# EAGLE design nixienet (EAGLE 6.3)
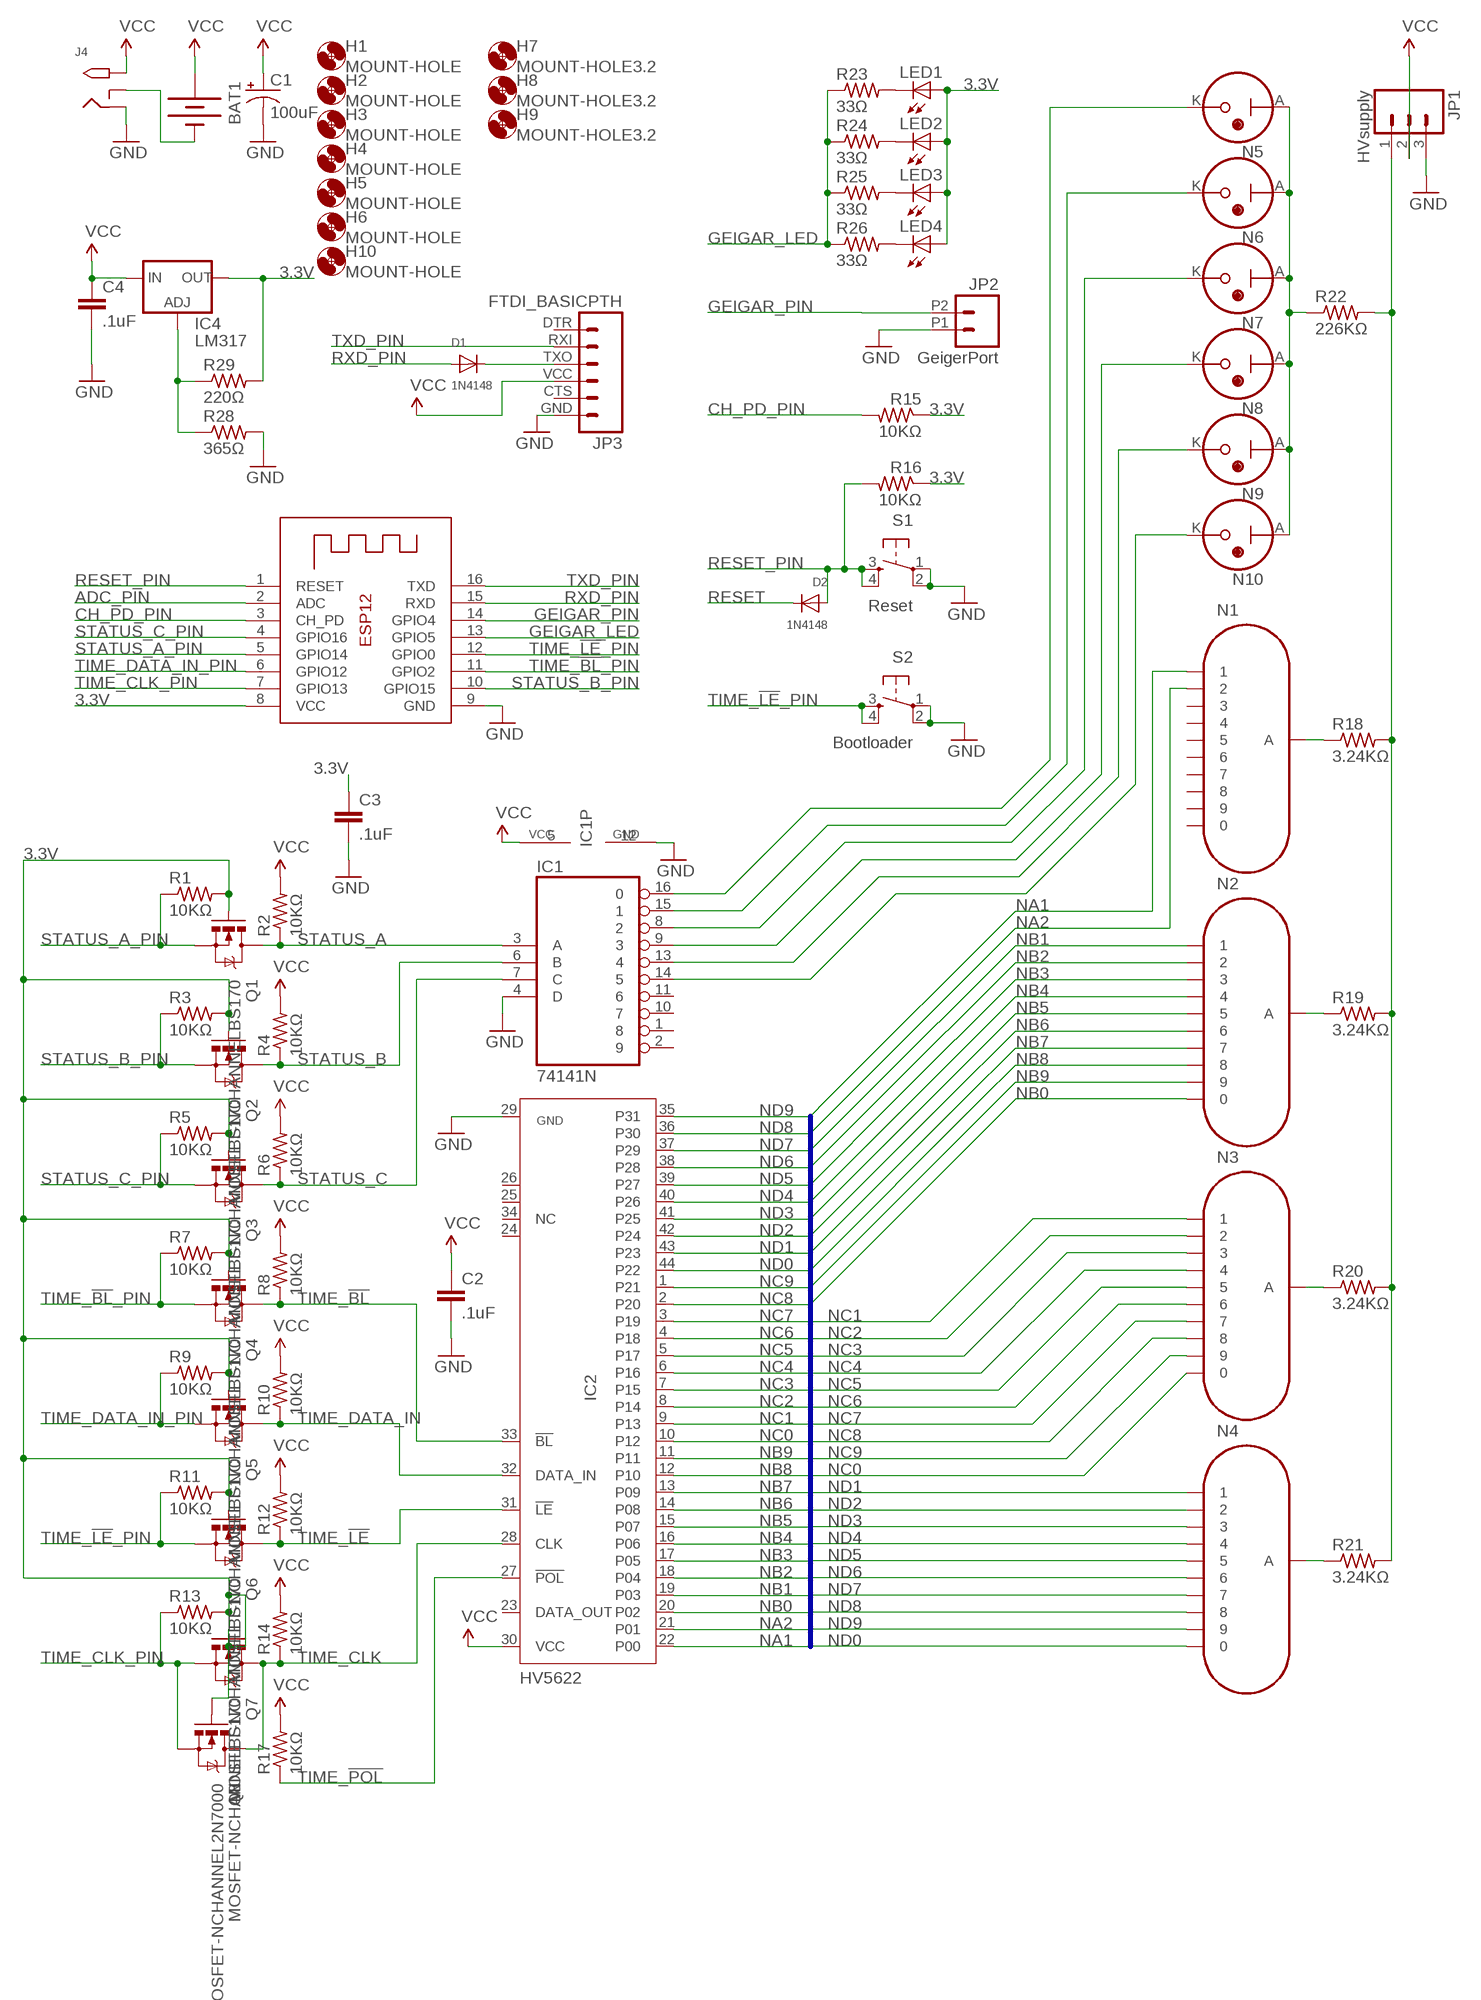
[diagram p0: schematic, sheet 1]

## Parts
BAT1  BATTERY9V  [BATTCON_9V]
C1  100uF  CPOL-USE5-8.5  [E5-8,5]
C2  .1uF  CAPEZ  [CAP-PTH-SMALLEZ]
C3  .1uF  CAPEZ  [CAP-PTH-SMALLEZ]
C4  .1uF  CAPEZ  [CAP-PTH-SMALLEZ]
D1  1N4148  DIODE  [1N4148]
D2  1N4148  DIODE  [1N4148]
H1  MOUNT-HOLE  [3,2-DANGER]
H2  MOUNT-HOLE  [3,2-DANGER]
H3  MOUNT-HOLE  [3,2-DANGER]
H4  MOUNT-HOLE  [3,2-DANGER]
H5  MOUNT-HOLE  [3,2-DANGER]
H6  MOUNT-HOLE  [3,2-DANGER]
H7  MOUNT-HOLE3.2  [3,2]
H8  MOUNT-HOLE3.2  [3,2]
H9  MOUNT-HOLE3.2  [3,2]
H10  MOUNT-HOLE  [3,2-DANGER]
IC1  74141N  [DIL16]
IC2  HV5622  [QFP44]
IC3  ESP-12  [ESP-12]
IC4  LM317  SPARKFUN-POWERIC_V_REG_317SINK  [SPARKFUN-POWERIC_TO220-ADJ]
J4  2.1MMJACKTHM  [PJ-102A]
JP1  HVsupply  M03-SCREW-5MM  [SCREWTERMINAL-5MM-3]
JP2  GeigerPort  M022.54MM_SCREWTERM  [1X02_2.54_SCREWTERM]
JP3  FTDI_BASICPTH  [FTDI_BASIC]
LED1  LED5MM  [LED5MM]
LED2  LED5MM  [LED5MM]
LED3  LED5MM  [LED5MM]
LED4  LED5MM  [LED5MM]
N1  Hour1  IN-4  [IN-18]
N2  Hour2  IN-4  [IN-18]
N3  Minutes1  IN-4  [IN-18]
N4  Minutes2  IN-4  [IN-18]
N5  TopBulb  INS-1  [INS-1]
N6  BottomBulb  INS-1  [INS-1]
N7  SunnyBulb  INS-1  [INS-1]
N8  CloudyBulb  INS-1  [INS-1]
N9  RainyBulb  INS-1  [INS-1]
N10  SnowyBulb  INS-1  [INS-1]
Q1  MOSFET-NCHANNELBS170  [TO-92]
Q2  MOSFET-NCHANNELBS170  [TO-92]
Q3  MOSFET-NCHANNELBS170  [TO-92]
Q4  MOSFET-NCHANNELBS170  [TO-92]
Q5  MOSFET-NCHANNELBS170  [TO-92]
Q6  MOSFET-NCHANNELBS170  [TO-92]
Q7  MOSFET-NCHANNELBS170  [TO-92]
Q8  MOSFET-NCHANNEL2N7000  [TO-92]
R1  10KΩ  R-US_0204/5  [0204/5]
R2  10KΩ  R-US_0204/5  [0204/5]
R3  10KΩ  R-US_0204/5  [0204/5]
R4  10KΩ  R-US_0204/5  [0204/5]
R5  10KΩ  R-US_0204/5  [0204/5]
R6  10KΩ  R-US_0204/5  [0204/5]
R7  10KΩ  R-US_0204/5  [0204/5]
R8  10KΩ  R-US_0204/5  [0204/5]
R9  10KΩ  R-US_0204/5  [0204/5]
R10  10KΩ  R-US_0204/5  [0204/5]
R11  10KΩ  R-US_0204/5  [0204/5]
R12  10KΩ  R-US_0204/5  [0204/5]
R13  10KΩ  R-US_0204/5  [0204/5]
R14  10KΩ  R-US_0204/5  [0204/5]
R15  10KΩ  R-US_0204/5  [0204/5]
R16  10KΩ  R-US_0204/5  [0204/5]
R17  10KΩ  R-US_0204/5  [0204/5]
R18  3.24KΩ  R-US_0204/5  [0204/5]
R19  3.24KΩ  R-US_0204/5  [0204/5]
R20  3.24KΩ  R-US_0204/5  [0204/5]
R21  3.24KΩ  R-US_0204/5  [0204/5]
R22  226KΩ  R-US_0204/5  [0204/5]
R23  33Ω  R-US_0204/5  [0204/5]
R24  33Ω  R-US_0204/5  [0204/5]
R25  33Ω  R-US_0204/5  [0204/5]
R26  33Ω  R-US_0204/5  [0204/5]
R28  365Ω  R-US_0204/5  [0204/5]
R29  220Ω  R-US_0204/5  [0204/5]
S1  Reset  TAC_SWITCHPTH  [TACTILE-PTH]
S2  Bootloader  TAC_SWITCHPTH  [TACTILE-PTH]

## Nets
3.3V [Power]: C3.1 IC3.8(VCC) IC4.OUT LED1.A LED2.A LED3.A LED4.A Q1.2(G) Q2.2(G) Q3.2(G) Q4.2(G) Q5.2(G) Q6.2(G) Q7.2(G) Q8.2(G) R1.2 R3.2 R5.2 R7.2 R9.2 R11.2 R13.2 R15.1 R16.1 R29.2
ADC_PIN: IC3.2(ADC)
CH_PD_PIN: IC3.3(CH_PD) R15.2
GEIGAR_LED: IC3.13(GPIO5) R23.1 R24.1 R25.1 R26.1
GEIGAR_PIN: IC3.14(GPIO4) JP2.P2
GND [Power]: C1.- C2.2 C3.2 C4.2 IC1.4(D) IC1.12(GND) IC2.29(GND) IC3.9(GND) J4.RING JP1.3 JP2.P1 JP3.GND R28.2 S1.1 S1.2 S2.1 S2.2
HV [Power]: JP1.1 R18.2 R19.2 R20.2 R21.2 R22.2
HV1 [Power]: N1.4(A) R18.1
HV2 [Power]: N2.4(A) R19.1
HV3 [Power]: N3.4(A) R20.1
HV4 [Power]: N4.4(A) R21.1
HVB [Power]: N5.A N6.A N7.A N8.A N9.A N10.A R22.1
N$1: IC4.ADJ R28.1 R29.1
N$2: IC1.14 N10.K
N$4: IC1.13 N9.K
N$5: IC1.9 N8.K
N$6: IC1.8 N7.K
N$7: IC1.15 N6.K
N$8: IC1.16 N5.K
N$18: D1.K(C) JP3.TXO
N$51: BAT1.- J4.RING_SW
N$52: LED1.K(C) R23.2
N$53: LED3.K(C) R25.2
N$54: LED4.K(C) R26.2
N$57: LED2.K(C) R24.2
NA1: IC2.22(P00) N1.14
NA2: IC2.21(P01) N1.9
NB0: IC2.20(P02) N2.8
NB1: IC2.19(P03) N2.14
NB2: IC2.18(P04) N2.9
NB3: IC2.17(P05) N2.11
NB4: IC2.16(P06) N2.1
NB5: IC2.15(P07) N2.12
NB6: IC2.14(P08) N2.2
NB7: IC2.13(P09) N2.6
NB8: IC2.12(P10) N2.3
NB9: IC2.11 N2.5
NC0: IC2.10(P12) N3.8
NC1: IC2.9(P13) N3.14
NC2: IC2.8(P14) N3.9
NC3: IC2.7(P15) N3.11
NC4: IC2.6(P16) N3.1
NC5: IC2.5(P17) N3.12
NC6: IC2.4(P18) N3.2
NC7: IC2.3(P19) N3.6
NC8: IC2.2(P20) N3.3
NC9: IC2.1(P21) N3.5
ND0: IC2.44(P22) N4.8
ND1: IC2.43(P23) N4.14
ND2: IC2.42(P24) N4.9
ND3: IC2.41(P25) N4.11
ND4: IC2.40(P26) N4.1
ND5: IC2.39(P27) N4.12
ND6: IC2.38(P28) N4.2
ND7: IC2.37(P29) N4.6
ND8: IC2.36(P30) N4.3
ND9: IC2.35(P31) N4.5
RESET: D2.K(C)
RESET_PIN: D2.A IC3.1(RESET) R16.2 S1.3 S1.4
RXD_PIN: D1.A IC3.15(RXD)
STATUS_A: IC1.3(A) Q1.1(D) R2.1
STATUS_A_PIN: IC3.5(GPIO14) Q1.3(S) R1.1
STATUS_B: IC1.6(B) Q2.1(D) R4.1
STATUS_B_PIN: IC3.10(GPIO15) Q2.3(S) R3.1
STATUS_C: IC1.7(C) Q3.1(D) R6.1
STATUS_C_PIN: IC3.4(GPIO16) Q3.3(S) R5.1
TIME_!BL: IC2.33(!BL) Q4.1(D) R8.1
TIME_!BL!_PIN: IC3.11(GPIO2) Q4.3(S) R7.1
TIME_!LE: IC2.31(!LE!) Q6.1(D) R12.1
TIME_!LE!_PIN: IC3.12(GPIO0) Q6.3(S) R11.1 S2.3 S2.4
TIME_!POL: IC2.27(!POL!) R17.1
TIME_CLK: IC2.28(CLK) Q7.1(D) Q8.3(D) R14.1
TIME_CLK_PIN: IC3.7(GPIO13) Q7.3(S) Q8.1(S) R13.1
TIME_DATA_IN: IC2.32(DATA_IN) Q5.1(D) R10.1
TIME_DATA_IN_PIN: IC3.6(GPIO12) Q5.3(S) R9.1
TXD_PIN: IC3.16(TXD) JP3.RXI
VCC [Power]: BAT1.+ C1.+ C2.1 C4.1 IC1.5(VCC) IC2.30(VCC) IC4.IN J4.TIP JP1.2 JP3.VCC R2.2 R4.2 R6.2 R8.2 R10.2 R12.2 R14.2 R17.2
Unconnected: IC1.1 IC1.2 IC1.10 IC1.11 IC2.23(DATA_OUT) IC2.24(NC) IC2.25(NC) IC2.26(NC) IC2.34(NC) JP3.CTS JP3.DTR N1.1 N1.2 N1.3 N1.5 N1.6 N1.8 N1.11 N1.12

## Buses
NA[1..2],NB[0..9],NC[0..9],ND[0..9]

## Library data of the parts
BAT1 = SparkFun-Electromechanical:BATTERY: Battery Holders Various common sizes : AA, AAA, 20mm coin cell and 12mm coin cell. 20MM_4LEGS, BATT-10373
C1 = adafruit:CPOL-US: POLARIZED CAPACITOR, American symbol
C2-C4 = SparkFun-Capacitors:CAP: Capacitor Standard 0603 ceramic capacitor, and 0.1" leaded capacitor.
D1 D2 = adafruit:DIODE: Diode SMADIODE - SMA Surface Mount Package 20V 1A Schottky Diode Digikey: 641-1014-6-ND DO-1N4148 - Through Hole Small Current Diode SOD-123 20V 1 A (.5mV Vf) Schottky Diode - Digikey: MBRX120TPMSCT-ND SOD-323 10V 570mA (.38mV Vf, 3ns) Schottky Diode - Digikey: ZLLS410CT-ND SOD-523 30V 30mA Schottky Diode (RB751S-40TE61) - Digikey: RB751S-40TE61CT-ND SOT23-R/W - SOT23 Package (R = Solder Paste/Reflow Ovens, W = Hand-Soldering) BAT54Film 40V 300mA - Digikey: 497-7162-1-ND
H1-H10 = holes:MOUNT-HOLE: MOUNTING HOLE with drill center marker
IC1 = 74xx-us:74*141: BCD to decimal DECODER/DRIVER
IC2 = nixie_tube:HV5622
IC3 = adafruit:ESP-12
IC4 = untitled:SPARKFUN-POWERIC_V_REG_317: Voltage Regulator Standard LM317 adjustable voltage regulator. AOI (Adjust Output Input). Google LM317 Calculator' for easy to use app to get the two resistor values needed. 240/720 for 5V output. 240/390 for 3.3V output. Spark Fun Electronics SKU : COM-00527'
J4 = adafruit:2.1MMJACK: 2.1mm x 5.5mm THM DC jack with internal switch. Digikey part #PJ-102A, 4UCON part #05537 2.1mm x 5.5mm SMT DC jack with internal switch. Digikey part #PJ-002A-SMT, 4UCON part #03267 By microbuilder.eu & adafruit.com
JP1 = SparkFun-Connectors:M03: Header 3 Standard 3-pin 0.1" header. Use with straight break away headers (SKU : PRT-00116), right angle break away headers (PRT-00553), swiss pins (PRT-00743), machine pins (PRT-00117), and female headers (PRT-00115). Molex polarized connector foot print use with SKU : PRT-08232 with associated crimp pins and housings.
JP2 = SparkFun-Connectors:M02: Standard 2-pin 0.1" header. Use with - straight break away headers ( PRT-00116) - right angle break away headers (PRT-00553) - swiss pins (PRT-00743) - machine pins (PRT-00117) - female headers (PRT-00115) Molex polarized connector foot print use with: PRT-08233 with associated crimp pins and housings. 2.54_SCREWTERM for use with PRT-10571. 3.5mm Screw Terminal footprints for PRT-08084 5mm Screw Terminal footprints for use with PRT-08433
JP3 = SparkFun-Connectors:FTDI_BASIC: FTDI Basic header with labels
LED1-LED4 = adafruit:LED: LED OSRAM: - CHIPLED LG R971, LG N971, LY N971, LG Q971, LY Q971, LO R971, LY R971 LH N974, LH R974 LS Q976, LO Q976, LY Q976 LO Q996 - Hyper CHIPLED LW Q18S LB Q993, LB Q99A, LB R99A - SideLED LS A670, LO A670, LY A670, LG A670, LP A670 LB A673, LV A673, LT A673, LW A673 LH A674 LY A675 LS A676, LA A676, LO A676, LY A676, LW A676 LS A679, LY A679, LG A679 - Hyper Micro SIDELED® LS Y876, LA Y876, LO Y876, LY Y876 LT Y87S - SmartLED LW L88C, LW L88S LB L89C, LB L89S, LG L890 LS L89K, LO L89K, LY L89K LS L896, LA L896, LO L896, LY L896 - TOPLED LS T670, LO T670, LY T670, LG T670, LP T670 LSG T670, LSP T670, LSY T670, LOP T670, LYG T670 LG T671, LOG T671, LSG T671 LB T673, LV T673, LT T673, LW T673 LH T674 LS T676, LA T676, LO T676, LY T676, LB T676, LH T676, LSB T676, LW T676 LB T67C, LV T67C, LT T67C, LS T67K, LO T67K, LY T67K, LW E67C LS E67B, LA E67B, LO E67B, LY E67B, LB E67C, LV E67C, LT E67C LW T67C LS T679, LY T679, LG T679 LS T770, LO T770, LY T770, LG T770, LP T770 LB T773, LV T773, LT T773, LW T773 LH T774 LS E675, LA E675, LY E675, LS T675 LS T776, LA T776, LO T776, LY T776, LB T776 LHGB T686 LT T68C, LB T68C - Hyper Mini TOPLED® LB M676 - Mini TOPLED Santana® LG M470 LS M47K, LO M47K, LY M47K Source: http://www.osram.convergy.de/
N1-N4 = russian-nixies:IN-4: IN-4: large numeric topview nixie tube
N5-N10 = russian-nixies:INS-1
Q1-Q8 = SparkFun-DiscreteSemi:MOSFET-NCHANNEL: Common NMOSFET Parts MFG P/N Store ID Prod ID FDD8780 TRANS-09984 SI7820DN TRANS-11055 FDS6630A IC-08089 2N7002PW TRANS-11151 FQP30N06L COM-10213 TRANS-10060 BSS123LT1G TRANS-08345 BSS138 TRANS-00830 BS170 2N7000
R1-R26 R28 R29 = adafruit:R-US_: RESISTOR, American symbol
S1 S2 = SparkFun-Electromechanical:TAC_SWITCH: Momentary Switch Button commonly used for reset or general input. Spark Fun Electronics SKU : COM-00097 SMT- SWCH-08247

## Net classes
1 Power: width 0.305 mm

## Board
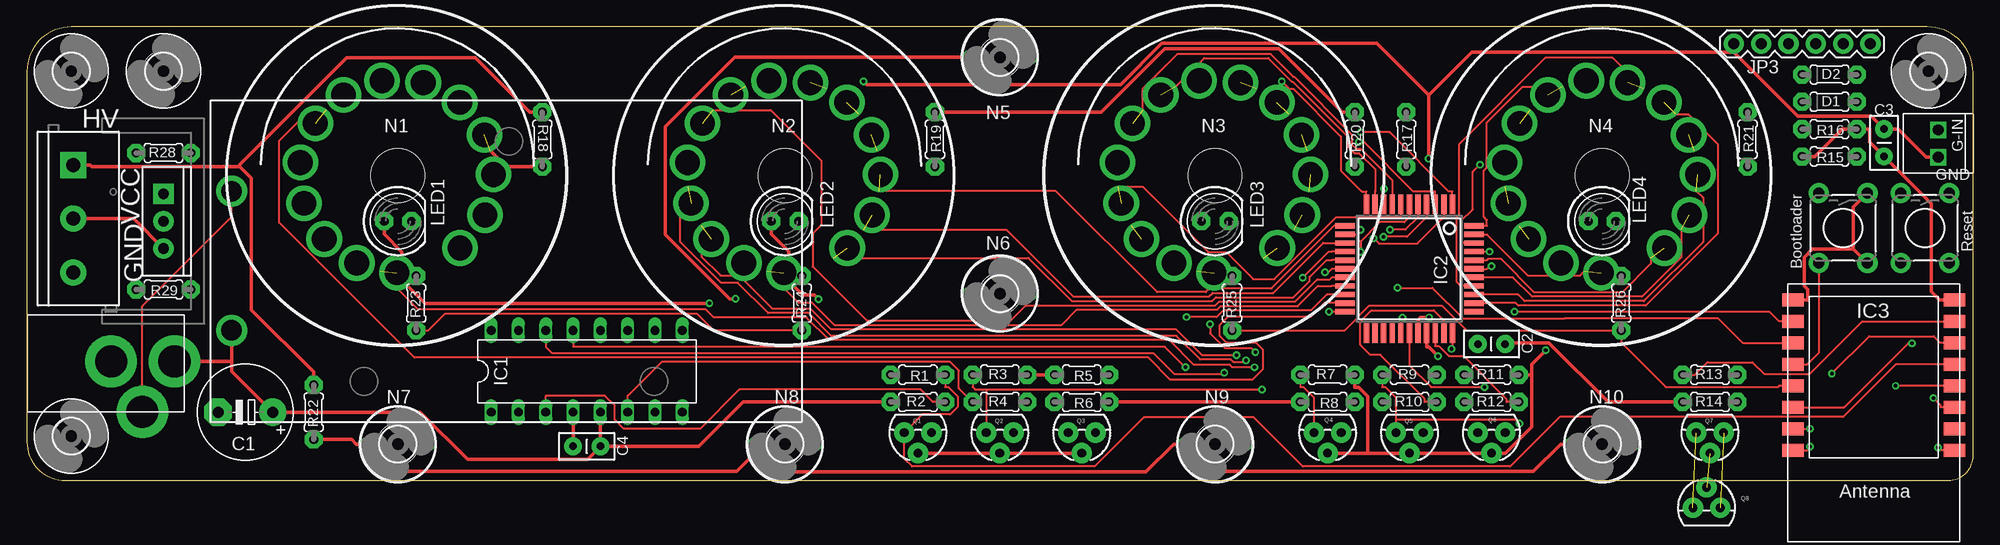
[diagram p1: board, top side]
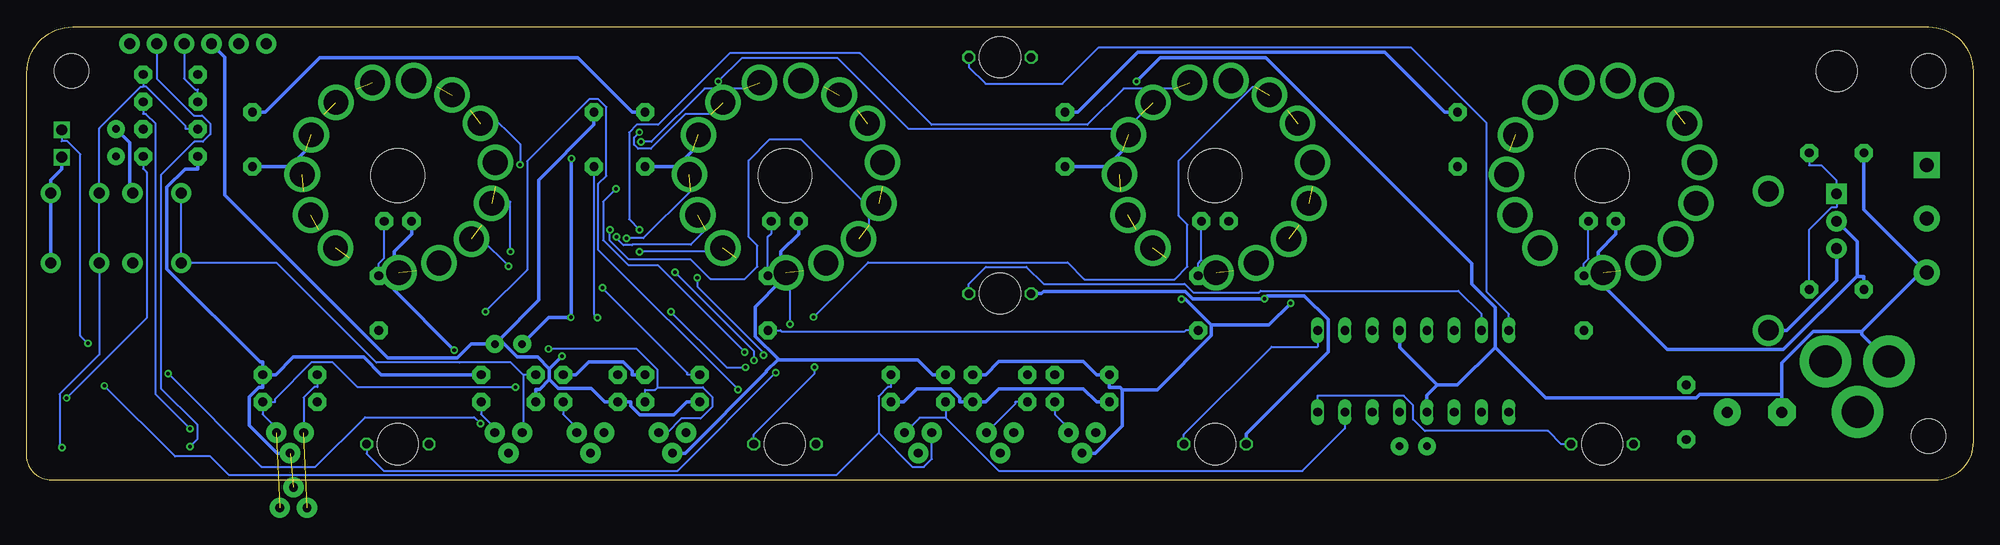
[diagram p2: board, bottom side, seen from below]

Size 181 x 42.22 mm. Coordinates in mm from the lower left corner, seen from the top.
Outline: 0,38.09 0,3.59 arc90 3.59,0 178.69,0 arc90 181,2.31 181,37.94 arc90 176.72,42.22 4.12,42.22 arc90 0,38.09
Copper layers (1*16): Top 0.0356mm / dielectric 1.5011mm / Bottom 0.0356mm
Design rules "OSHparkPCBorder *": minimum track width 8mil, minimum drill 13mil, track to track 8mil, track to pad 8mil, pad to pad 8mil, via to via 8mil, smd to smd 8mil, copper to edge 15mil, drill to drill 8mil, minimum pad ring 7mil, minimum via ring 7mil, stop-mask expansion 3mil, vias tented up to drill 14mil, thermal gap 10mil

### Footprints (pad centres in the part's own frame; a part is rotated, then mirrored left to right if it is on the bottom)
BATTCON_9V = drill 1.905: + 0,0; - 0,-12.954
E5-8,5 = drill 1.016 pad 2.54: + -2.54,0 | drill 1.016 pad 2.54 octagon: - 2.54,0
CAP-PTH-SMALLEZ = drill 0.7 pad 1.651: 1 0,0; 2 2.54,0
1N4148 = drill 0.813 pad 1.676 octagon: A -2.54,0; K 2.54,0
3,2-DANGER = hole 3.81: 0,0
3,2 = hole 3.2: 0,0
DIL16 = drill 0.813 long: 1 -8.89,-3.81; 2 -6.35,-3.81; 3 -3.81,-3.81; 4 -1.27,-3.81; 5 1.27,-3.81; 6 3.81,-3.81; 7 6.35,-3.81; 8 8.89,-3.81; 9 8.89,3.81; 10 6.35,3.81; 11 3.81,3.81; 12 1.27,3.81; 13 -1.27,3.81; 14 -3.81,3.81; 15 -6.35,3.81; 16 -8.89,3.81
QFP44 = smd 0.5 x 1.8: 1 -4,-6; 2 -3.2,-6; 3 -2.4,-6; 4 -1.6,-6; 5 -0.8,-6; 6 0,-6; 7 0.8,-6; 8 1.6,-6; 9 2.4,-6; 10 3.2,-6; 11 4,-6; 23 4,6; 24 3.2,6; 25 2.4,6; 26 1.6,6; 27 0.8,6; 28 0,6; 29 -0.8,6; 30 -1.6,6; 31 -2.4,6; 32 -3.2,6; 33 -4,6 | smd 1.8 x 0.5: 12 6,-4; 13 6,-3.2; 14 6,-2.4; 15 6,-1.6; 16 6,-0.8; 17 6,0; 18 6,0.8; 19 6,1.6; 20 6,2.4; 21 6,3.2; 22 6,4; 34 -6,4; 35 -6,3.2; 36 -6,2.4; 37 -6,1.6; 38 -6,0.8; 39 -6,0; 40 -6,-0.8; 41 -6,-1.6; 42 -6,-2.4; 43 -6,-3.2; 44 -6,-4
ESP-12 = smd 2 x 1.2: 1 -7.5,4.5; 2 -7.5,2.5; 3 -7.5,0.5; 4 -7.5,-1.5; 5 -7.5,-3.5; 6 -7.5,-5.5; 7 -7.5,-7.5; 8 -7.5,-9.5; 9 7.5,-9.5; 10 7.5,-7.5; 11 7.5,-5.5; 12 7.5,-3.5; 13 7.5,-1.5; 14 7.5,0.5; 15 7.5,2.5; 16 7.5,4.5
SPARKFUN-POWERIC_TO220-ADJ = drill 1 pad 1.88 square: ADJ -2.54,0 | drill 1 pad 1.88: IN 2.54,0; OUT 0,0
PJ-102A = drill 3 pad 4.8: RING 0.1,-3.39; RING_SW -4.6,-6.29; TIP 0.1,-9.29
SCREWTERMINAL-5MM-3 = drill 1.3 pad 2.413 square: 1 0,0 | drill 1.3 pad 2.413: 2 5,0; 3 10,0
1X02_2.54_SCREWTERM = drill 1.016 square: P1 2.54,0; P2 0,0
FTDI_BASIC = drill 1.016 pad 1.88: CTS 10.16,0; DTR 0,0; GND 12.7,0; RXI 2.54,0; TXO 5.08,0; VCC 7.62,0
LED5MM = drill 0.813 pad 1.676 octagon: A -1.27,0; K 1.27,0
IN-18 = drill 2.3 pad 3.2: 1 5.79,-6.752; 2 8.111,-3.684; 3 8.886,0.098; 4 8.047,3.789; 5 5.758,6.804; 6 2.364,8.642; 7 -1.479,8.836; 8 -5.049,7.502; 9 -7.672,4.845; 10 -9.069,1.215; 11 -8.725,-2.598; 12 -6.848,-5.915; 13 -3.822,-8.145; 14 -0.088,-9.052 | hole 5: 0,0
INS-1 = drill 0.8 octagon: A -2.9,0; K 2.9,0
TO-92 = drill 0.813 pad 1.88: 1 -1.27,0; 2 0,1.905; 3 1.27,0
0204/5 = drill 0.813 pad 1.676 octagon: 1 -2.54,0; 2 2.54,0
TACTILE-PTH = drill 1.016 pad 1.88: 1 -3.251,2.261; 2 3.251,2.261; 3 -3.251,-2.261; 4 3.251,-2.261

### Placement (x,y rotation side)
BAT1  19.05,13.97 180 top
C1  20.32,6.35 180 top
C2  137.48,12.7 180 top
C3  172.72,30.16 90 top
C4  53.34,3.17 180 top
D1  167.64,35.24 180 top
D2  167.64,37.78 180 top
H1  34.5,3.38 0 top
H2  70.5,3.38 0 top
H3  110.5,3.38 0 top
H4  90.5,17.38 0 top
H5  90.5,39.38 0 top
H6  146.5,3.38 0 top
H7  4.13,38.1 0 top
H8  176.85,38.1 0 top
H9  4.13,4.13 0 top
H10  12.7,38.1 0 top
IC1  52.07,10.16 0 top
IC2  128.57,19.7 180 top
IC3  171.77,7.3 180 top
IC4  12.7,24.13 270 top
J4  4.45,10.98 90 top
JP1  4.33,29.37 270 top
JP2  177.76,32.63 270 top
JP3  171.45,40.64 180 top
LED1  34.5,24.13 0 top
LED2  70.5,24.13 0 top
LED3  110.5,24.13 0 top
LED4  146.5,24.13 0 top
N1  34.5,28.38 0 top
N2  70.5,28.38 0 top
N3  110.5,28.38 0 top
N4  146.5,28.38 0 top
N5  90.5,39.38 0 top
N6  90.5,17.38 0 top
N7  34.5,3.38 0 top
N8  70.5,3.38 0 top
N9  110.5,3.38 0 top
N10  146.5,3.38 0 top
Q1  82.87,4.45 180 top
Q2  90.49,4.45 180 top
Q3  98.11,4.45 180 top
Q4  120.97,4.45 180 top
Q5  128.59,4.45 180 top
Q6  136.21,4.45 180 top
Q7  156.53,4.45 180 top
Q8  156.21,-2.54 0 top
R1  82.87,9.84 180 top
R2  82.87,7.3 180 top
R3  90.49,9.84 0 top
R4  90.49,7.3 0 top
R5  98.11,9.84 180 top
R6  98.11,7.3 0 top
R7  120.97,9.84 0 top
R8  120.97,7.3 180 top
R9  128.59,9.84 0 top
R10  128.59,7.3 180 top
R11  136.21,9.84 0 top
R12  136.21,7.3 180 top
R13  156.53,9.84 0 top
R14  156.53,7.3 180 top
R15  167.64,30.16 0 top
R16  167.64,32.7 180 top
R17  128.27,31.75 90 top
R18  47.94,31.75 90 top
R19  84.45,31.75 90 top
R20  123.51,31.75 90 top
R21  160.02,31.75 90 top
R22  26.67,6.35 90 top
R23  36.2,16.51 90 top
R24  72.07,16.51 90 top
R25  112.08,16.51 90 top
R26  148.27,16.51 90 top
R28  12.7,30.48 180 top
R29  12.7,17.78 180 top
S1  176.53,23.5 270 top
S2  168.91,23.5 270 top

### Tracks (layer width: path | path; a pad name or v marks a point on that pad's centre or on a via)
3.3V  (via drill 0.33 pad 0.69)  (1 unrouted)
  Top 0.305: 139.94,9.84 139.94,5 137.48,2.54 Q6.2 Q5.2 124.72,2.54 | R11.2 139.94,9.84 | 139.94,9.84 139.94,10.8 v141.25,12.12 | Q4.2 124.72,2.54 | 124.72,2.54 124.72,7.81 123.88,8.65 123.51,8.65 R7.2 | R15.1 166.29,30.16 168.83,32.7 R16.1 171.37,32.7 171.37,31.51 C3.1 177.12,25.76 177.12,17.59 177.91,16.8 IC3.8 | v63.46,16.48 37.03,16.48 34.88,18.64 34.88,21.28 33.23,22.94 LED1.A | v73.63,16.88 73.24,17.27 72.15,17.27 70.86,18.56 70.86,21.31 69.23,22.94 LED2.A | R3.2 R5.2 | Q3.2 Q2.2 Q1.2
  Bottom 0.305: R9.2 129.93,9.84 128.73,11.05 125.53,11.05 124.7,10.22 124.7,9.84 R7.2 | LED4.A 145.23,22.94 146.85,21.31 146.85,17.72 v141.25,12.12 | R13.2 159.07,11.04 159.31,11.04 167.98,19.7 167.98,27.28 166.29,28.97 165.1,28.97 R15.1 | R13.2 157.87,9.84 156.21,11.5 149.68,11.5 148.02,9.84 R11.2 | 111.19,11.23 112.22,10.2 112.22,10.08 119.76,2.54 Q4.2 | 111.19,11.23 111.19,11.34 113.27,13.42 113.27,16.15 110.87,18.55 110.87,21.3 109.23,22.94 LED3.A | 111.19,11.23 98.15,11.23 96.76,9.84 R5.2 | 70.86,14.46 73.28,16.88 v73.63,16.88 | v73.63,16.88 | 79.13,8.45 75.89,8.45 70.86,13.48 70.86,14.46 | 70.86,14.46 65.49,14.46 v63.46,16.48 | 79.13,8.45 79.33,8.65 80.33,8.65 R1.2 81.52,9.84 82.76,11.08 90.6,11.08 91.83,9.84 R3.2 | 79.13,8.45 79.13,5.07 81.65,2.54 Q1.2 | LED1.A 33.23,22.94 34.88,21.28 34.88,18.62 28.44,12.18 17.64,12.18 10.79,19.03 | R29.2 10.16,18.97 10.74,18.97 10.79,19.03 | 10.79,19.03 10.79,22.22 IC4.OUT | R13.2 159.07,8.65 159.44,8.65 160.3,7.79 160.3,5.11 157.73,2.54 Q7.2
CH_PD_PIN  (via drill 0.33 pad 0.69)
  Top 0.203: IC3.3 177.96,6.8 177.96,7.01 v177.3,7.68
  Bottom 0.203: R15.2 170.18,29.02 169.86,28.7 169.86,15.11 v177.3,7.68
GEIGAR_LED
  Top 0.203: R25.1 122.56,13.97 124.86,16.27 131.59,16.27 133.89,13.97 R26.1 148.27,12.83 152.41,8.69 162.85,8.69 162.96,8.8 IC3.13 | R23.1 37.34,13.97 38.88,15.51 62.34,15.51 63.88,13.97 R24.1
  Bottom 0.203: R24.1 73.22,13.97 73.31,13.88 110.84,13.88 110.93,13.97 R25.1
GEIGAR_PIN  (via drill 0.33 pad 0.69)
  Top 0.203: IC3.14 169,6.8 174.96,12.76 v175.32,12.76
  Bottom 0.203: v175.32,12.76 176.03,13.46 176.03,30.37 177.22,31.56 177.76,31.56 JP2.P2
GND  (via drill 0.33 pad 0.69)
  Top 0.305: 130.36,35.86 v130.36,29.95 | 169.87,21.54 166.06,21.54 165.28,20.76 165.28,18.1 165.62,17.76 165.62,16.8 IC3.9 | S2.2 169.87,21.54 | S2.1 169.87,25.45 169.87,21.54 | 130.36,35.86 125.55,40.67 105.55,40.67 101.73,36.85 78.1,36.85 v77.82,37.13 | 158.75,39.85 134.36,39.85 130.36,35.86 | IC1.4 C4.2 | 158.75,39.85 JP3.GND | 158.75,39.85 164.71,33.9 171.53,33.9 C3.2 174.03,32.7 176.64,30.09 JP2.P1 | IC2.29 129.38,14.96 129.59,15.17 v130.42,15.17
  Bottom 0.305: v130.36,29.95 130.36,15.23 v130.42,15.17 132.46,15.17 C2.2 | 44.45,12.4 44.45,16.12 46.63,18.3 46.63,20.19 65.8,39.36 75.59,39.36 v77.82,37.13 | 44.45,12.4 39.74,7.69 25.76,7.69 25.44,8.01 17.78,8.01 | 44.45,12.4 47.96,8.89 49.84,8.89 | 4.58,19.62 10.16,25.2 10.16,29.29 R28.2 | JP1.3 4.58,19.62 | 4.58,19.62 10.34,13.85 | 10.34,13.85 10.34,13.58 J4.RING | 17.78,8.01 17.78,10.95 14.88,13.85 10.34,13.85 | 17.78,8.01 C1.- | 49.84,8.89 50.8,7.92 IC1.4 | 49.84,8.89 53.34,12.39 IC1.12 | JP2.P1 177.76,28.97 178.79,27.94 S1.1 S1.2 | S2.1 171.46,27.03 171.46,31.44 C3.2
HV
  Top 0.305: R20.2 122.31,34.29 116.44,40.17 105.81,40.17 99.93,34.29 R19.2 | R18.2 46.75,34.29 41.68,39.36 29.74,39.36 19.78,29.4 19.78,29.21 | 19.78,29.21 20.87,28.13 20.87,15.89 26.67,10.08 R22.2 | 19.78,29.21 6.05,29.21 5.89,29.37 JP1.1
  Bottom 0.305: R19.2 83.26,34.29 77.69,39.87 54.71,39.87 49.14,34.29 R18.2 | R20.2 124.7,34.29 129.77,39.36 153.76,39.36 158.83,34.29 R21.2
HV1  (1 unrouted)
  Top 0.305: R18.1 44.59,29.21 43.08,30.71
HV2  (1 unrouted)
  Bottom 0.305: R19.1 80.59,29.21 79.08,30.71
HV3  (1 unrouted)
  Bottom 0.305: R20.1 120.59,29.21 119.08,30.71
HV4  (1 unrouted)
  Bottom 0.305: R21.1 156.59,29.21 155.08,30.71
HVB  (via drill 0.33 pad 0.69)
  Top 0.305: N10.A 142.64,3.38 140.1,0.83 109.19,0.83 107.6,2.42 N9.A 106.64,3.38 104.07,0.8 69.22,0.8 67.6,2.42 | 67.6,2.42 66.01,0.83 33.19,0.83 31.6,2.42 N7.A 30.64,3.38 30.21,3.81 R22.1 | N5.A 86.64,39.38 65.83,39.38 59.39,32.94 59.39,22.89 65.37,16.91 v65.91,16.91 | N8.A 67.6,2.42
  Bottom 0.305: N8.A 67.6,4.34 59.99,11.95 59.99,14.98 62.19,17.18 65.64,17.18 v65.91,16.91 72.59,16.91 73.27,17.58 86.44,17.58 86.64,17.38 N6.A
N$1
  Bottom 0.203: R28.1 15.24,29.34 14.12,29.34 12.7,27.91 IC4.ADJ 12.7,25.43 13.17,25.43 15.24,23.35 R29.1
N$2  (via drill 0.33 pad 0.69)
  Top 0.203: v111.35,10.03 111.19,9.87 106.75,9.87 104.79,11.84 48.87,11.84 48.26,12.45 IC1.14
  Bottom 0.203: v111.35,10.03 120.49,0.9 147.82,0.9 149.4,2.48 N10.K
N$4  (via drill 0.33 pad 0.69)
  Top 0.203: v107.74,10.53 105.82,12.45 50.8,12.45 IC1.13
  Bottom 0.203: v107.74,10.53 107.74,9.95 113.4,4.29 N9.K
N$5
  Bottom 0.203: IC1.9 60.96,12.45 65.24,12.45 73.4,4.29 N8.K
N$6
  Bottom 0.203: IC1.8 60.96,7.87 52.94,7.87 52.07,7.01 52.07,5.68 51,4.61 39.53,4.61 38.3,3.38 N7.K
N$7
  Bottom 0.203: IC1.15 45.72,15.49 47.87,17.64 66.25,17.64 66.39,17.5 72.53,17.5 73.33,18.29 86.45,18.29 88.04,19.88 91.81,19.88 93.4,18.29 N6.K
N$8
  Bottom 0.203: IC1.16 43.18,15.49 45.27,17.59 45.27,33.29 52.3,40.32 81.29,40.32 84.7,36.92 91.84,36.92 93.4,38.48 N5.K
N$18
  Bottom 0.203: D1.K 165.1,36.39 165.34,36.39 166.37,37.42 JP3.TXO
N$51
  Top 0.203: J4.RING_SW 10.74,16.24 19.05,24.55 BAT1.-
N$52
  Bottom 0.203: R23.2 36.2,20.19 35.77,20.62 LED1.K
N$53
  Bottom 0.203: LED3.K 111.77,22.99 112.08,22.68 R25.2
N$54
  Bottom 0.203: R26.2 148.27,20.19 147.77,20.7 LED4.K
N$57
  Bottom 0.203: R24.2 72.07,20.19 71.77,20.5 LED2.K
NA1  (via drill 0.33 pad 0.69)  (1 unrouted)
  Top 0.203: v114.17,10.52 112.11,10.52 111.87,10.77 108.51,10.77 106.22,13.06 74.6,13.06 72.48,15.18 63.86,15.18 63.11,15.92 36.4,15.92 32.84,19.48 | v121.11,15.7 121.37,15.7 IC2.22
  Bottom 0.203: v121.11,15.7 115.93,10.52 v114.17,10.52
NA2  (1 unrouted)
  Top 0.203: IC2.21 120.67,16.5 119.39,15.22 111.67,15.22 110.89,14.44 110.89,13.49 111.56,12.83 114.28,12.83 114.91,12.2 114.91,10.33 113.95,9.37 106.35,9.37 104.29,11.43 36.03,11.43 23.46,24 23.46,31.62 26.32,34.48 27.79,34.48
NB0  (via drill 0.33 pad 0.69)  (1 unrouted)
  Top 0.203: IC2.20 120.9,17.3 119.42,15.83 111.27,15.83 110.65,15.21 v107.84,15.21
  Bottom 0.203: v107.84,15.21 102.76,20.29 84.22,20.29 82.64,18.71 74.27,18.71 73.07,19.91 73.07,23.81 73.87,24.61 73.87,29.79 67.01,36.65 66.83,36.65
NB1  (1 unrouted)
  Top 0.203: 68.84,19.48 71.74,16.58 72.98,16.58 75.08,14.49 96.25,14.49 97.65,15.89 110.71,15.89 111.05,16.23 118.2,16.23 120.07,18.1 121.37,18.1 IC2.19
NB2  (1 unrouted)
  Top 0.203: 63.79,34.48 69.17,34.48 73.87,29.77 73.87,23.79 73.07,22.99 73.07,19.91 78.08,14.89 91.5,14.89 92.9,16.3 110.52,16.3 110.87,16.64 117.95,16.64 120.02,18.71 121.18,18.71 121.37,18.9 IC2.18
NB3  (via drill 0.33 pad 0.69)  (1 unrouted)
  Top 0.203: v113.39,11.17 113.21,10.99 112.22,10.99 111.96,11.25 109.11,11.25 106.9,13.46 74.83,13.46 72.7,15.58 68.94,15.58 66.12,18.4 64.56,18.4 60.75,22.21 60.75,26.63 61.46,27.34 | v120.71,19.36 121.03,19.36 121.37,19.7 IC2.17
  Bottom 0.203: v120.71,19.36 113.39,12.04 v113.39,11.17
NB4  (1 unrouted)
  Top 0.203: 75.03,20.73 93.14,20.73 97.16,16.7 110.24,16.7 110.58,17.05 117.78,17.05 119.3,18.57 119.3,18.94 120.87,20.5 121.37,20.5 IC2.16
NB5  (via drill 0.33 pad 0.69)  (1 unrouted)
  Top 0.203: 62.73,23.74 62.73,20.84 64.51,19.06 66.24,19.06 69.3,16 72.86,16 74.78,14.08 106.86,14.08 109.28,11.66 v112.51,11.66 | v118.66,18.88 121.08,21.3 121.37,21.3 IC2.15
  Bottom 0.203: v118.66,18.88 118.66,18.06 112.51,11.91 v112.51,11.66
NB6  (1 unrouted)
  Top 0.203: 77.85,23.34 91.1,23.34 97.33,17.11 109.93,17.11 110.27,17.45 115.9,17.45 120.54,22.1 IC2.14
NB7  (via drill 0.33 pad 0.69)  (1 unrouted)
  Top 0.203: v124.03,23.35 123.78,23.1 123.78,22.9 IC2.13
  Bottom 0.203: 74.33,36.48 79.01,36.48 82.38,33.12 96.87,33.12 103.51,39.75 115.64,39.75 122.29,33.11 124.28,33.11 125,32.4 125,24.31 v124.03,23.35
NB8  (1 unrouted)
  Top 0.203: IC2.12 121.57,23.7 115.73,17.86 110,17.86 109.65,17.52 105.11,17.52 95.69,26.93 79.27,26.93
NB9  (via drill 0.33 pad 0.69)  (1 unrouted)
  Top 0.203: IC2.11 124.58,26.91 124.16,26.91 122.21,28.86 122.21,32.01 117.76,36.46 117.38,36.46 v116.7,37.14
  Bottom 0.203: 77.35,34.08 78.72,32.71 98.99,32.71 105.58,39.3 114.54,39.3 v116.7,37.14
NC0  (1 unrouted)
  Top 0.203: 106.83,36.65 109.49,39.3 115.46,39.3 117.35,37.41 | 117.35,37.41 | 117.35,37.41 117.65,37.11 117.71,37.11 122.83,31.99 122.83,31.09 123.45,30.47 123.89,30.47 125.38,28.98 125.38,26.91 IC2.10
NC1  (via drill 0.33 pad 0.69)  (1 unrouted)
  Top 0.203: IC2.9 126.17,27.13 v126.2,27.16 | v110.05,14.54 110.05,13.69 111.41,12.32 113.86,12.32 v114.24,11.94
  Bottom 0.203: v126.2,27.16 127.41,25.95 127.41,22.37 125.06,20.03 122.33,20.03 v114.24,11.94 | 108.84,19.48 110.05,18.27 v110.05,14.54
NC2  (1 unrouted)
  Top 0.203: 103.79,34.48 103.79,36.46 107.04,39.71 115.62,39.71 117.76,37.58 | 117.76,37.58 | 117.76,37.58 117.84,37.58 123.24,32.19 123.24,31.26 123.61,30.88 124.05,30.88 126.97,27.96 IC2.8
NC3  (1 unrouted)
  Top 0.203: IC2.7 127.78,24.5 121.79,24.5 116.03,18.74 114.04,18.74 111.53,21.25 109.85,21.25 103.76,27.34 101.46,27.34
NC4  (via drill 0.33 pad 0.69)  (1 unrouted)
  Top 0.203: v124.04,21.29 124.04,22.26 125.81,24.03 128.1,24.03 128.57,24.5 IC2.6
  Bottom 0.203: 115.03,20.73 115.6,21.29 v124.04,21.29
NC5  (via drill 0.33 pad 0.69)  (1 unrouted)
  Top 0.203: v126.76,23.33 128.21,23.33 129.38,24.5 IC2.5
  Bottom 0.203: v126.76,23.33 126.82,23.27 126.82,22.38 125.05,20.61 119.3,20.61 117.44,18.75 114.23,18.75 113.07,19.91 113.07,21.86 113.88,22.68 113.88,29.79 111.93,31.75 109.04,31.75 102.73,25.44 102.73,23.74
NC6  (via drill 0.33 pad 0.69)  (1 unrouted)
  Top 0.203: v126.15,22.68 128.36,22.68 130.18,24.5 IC2.4
  Bottom 0.203: 117.85,23.34 119.25,21.94 124.68,21.94 124.73,21.89 125.54,21.89 126.15,22.51 v126.15,22.68
NC7  (via drill 0.33 pad 0.69)  (1 unrouted)
  Top 0.203: v123.88,31.53 124.32,31.53 128.94,26.91 130.97,26.91 IC2.3
  Bottom 0.203: 114.33,36.48 117.96,36.48 122.92,31.53 v123.88,31.53
NC8  (via drill 0.33 pad 0.69)  (1 unrouted)
  Top 0.203: v125.24,22.54 125.75,22.03 129.31,22.03 131.78,24.5 IC2.2
  Bottom 0.203: 119.27,26.93 123.66,22.54 v125.24,22.54
NC9  (via drill 0.33 pad 0.69)  (1 unrouted)
  Top 0.203: v124.04,32.42 126.74,32.42 132.25,26.91 132.57,26.91 IC2.1
  Bottom 0.203: 117.35,34.08 119.78,34.08 122.98,30.88 124.17,30.88 124.53,31.25 124.53,31.93 v124.04,32.42
ND0  (1 unrouted)
  Top 0.203: 142.83,36.65 139.12,36.65 135.78,33.31 135.78,29.12 135.48,28.82 135.48,24.56 135.78,24.26 135.78,23.7 IC2.44
ND1  (1 unrouted)
  Top 0.203: IC2.43 135.78,22.9 139.63,19.05 144.41,19.05 144.84,19.48
ND2  (via drill 0.33 pad 0.69)  (1 unrouted)
  Top 0.203: v135.13,29.39 134.48,28.74 134.48,25.23 133.37,24.13 133.37,22.1 IC2.42
  Bottom 0.203: 139.79,34.48 138.32,34.48 135.13,31.3 v135.13,29.39
ND3  (via drill 0.33 pad 0.69)  (1 unrouted)
  Top 0.203: v136.04,21.3 135.78,21.3 IC2.41
  Bottom 0.203: v136.04,21.3 136.04,25.92 137.46,27.34
ND4  (1 unrouted)
  Top 0.203: 151.03,20.73 151.03,20.19 148.36,17.52 140.21,17.52 137.13,20.59 135.87,20.59 135.78,20.5 IC2.40
ND5  (via drill 0.33 pad 0.69)  (1 unrouted)
  Top 0.203: IC2.39 135.78,19.7 136.02,19.94 v136.2,19.94
  Bottom 0.203: 138.73,23.74 138.73,22.47 v136.2,19.94
ND6  (1 unrouted)
  Top 0.203: 153.85,23.34 153.85,20.75 150.21,17.11 139.98,17.11 138.19,18.9 IC2.38
ND7  (1 unrouted)
  Top 0.203: IC2.37 133.37,18.1 132.95,18.52 132.95,24.48 133.17,24.7 133.17,31.27 141.23,39.34 147.47,39.34 150.33,36.48
ND8  (1 unrouted)
  Top 0.203: 155.27,26.93 155.88,26.32 155.88,22.21 150.38,16.7 139.29,16.7 138.69,17.3 IC2.36
ND9  (1 unrouted)
  Top 0.203: 153.35,34.08 154.49,34.08 157.25,31.33 157.25,22.97 150.55,16.27 138.72,16.27 138.49,16.5 135.78,16.5 IC2.35
RESET_PIN  (via drill 0.33 pad 0.69)
  Top 0.203: v177.72,3.05 177.96,2.8 IC3.1
  Bottom 0.203: v177.72,3.05 177.94,3.27 177.94,8.04 174.27,11.71 S1.4 S1.3 174.27,32.77 170.4,36.64 170.18,36.64 | R16.2 166.24,32.7 166.24,32.99 169.89,36.64 170.18,36.64 | D2.A 170.18,36.64
RXD_PIN  (via drill 0.33 pad 0.69)
  Top 0.203: v165.82,4.8 165.57,4.8 IC3.15
  Bottom 0.203: v165.82,4.8 169.04,8.01 169.04,33.19 169.94,34.1 170.18,34.1 D1.A
STATUS_A
  Top 0.203: IC1.3 48.26,7.87 53.74,7.87 54.66,6.96 54.66,5.67 55.5,4.82 62.61,4.82 66.25,8.46 83.11,8.46 84.26,7.3 R2.1
  Bottom 0.203: Q1.1 84.14,4.89 85.41,6.16 R2.1
STATUS_A_PIN
  Top 0.203: IC3.5 173.81,10.8 168.91,5.9 142.55,5.9 137.94,1.29 118.67,1.29 114.11,5.86 103.88,5.86 99.31,1.29 82.34,1.29 81.6,2.03 Q1.3 83.29,6.13 85.87,6.13 86.59,6.86 86.59,7.8 85.69,8.7 85.41,8.7 R1.1
STATUS_B
  Top 0.203: IC1.6 55.88,7.87 59.03,11.02 85.89,11.02 86.68,10.23 86.68,8.57 R4.1
  Bottom 0.203: R4.1 89.09,7.3 89.09,7.11 Q2.1
STATUS_B_PIN  (via drill 0.33 pad 0.69)
  Top 0.203: 89.22,8.45 v114.85,8.45 | IC3.10 162.96,14.8 162.06,15.71 v138.37,15.71 | 89.22,8.45 Q2.3 | 89.22,8.45 88.2,8.45 87.95,8.7 R3.1
  Bottom 0.203: v114.85,8.45 127.85,21.45 127.85,27.61 127.12,28.34 127.12,34.76 127.85,35.48 128.71,35.48 134.48,29.71 134.48,19.59 v138.37,15.71
STATUS_C
  Bottom 0.203: 95.57,5.84 90.6,0.87 62.37,0.87 58.42,4.83 IC1.7 | R6.1 95.57,5.84 | 95.57,5.84 97.98,5.84 Q3.1
STATUS_C_PIN  (via drill 0.33 pad 0.69)
  Top 0.203: v173.8,8.8 177.96,8.8 IC3.4
  Bottom 0.203: 101.8,4.41 105.71,0.49 162.2,0.49 163.93,2.22 167.22,2.22 v173.8,8.8 | 101.8,4.41 98.64,1.25 97.58,1.25 96.84,2 Q3.3 | 101.8,4.41 101.8,7.84 100.93,8.7 100.65,8.7 R5.1
TIME_!BL  (via drill 0.33 pad 0.69)
  Top 0.203: v132.49,12.24 132.49,12.41 132.57,12.5 IC2.33
  Bottom 0.203: 122.34,8.67 118.14,8.67 117.27,7.8 117.27,6.83 118.34,5.76 120.15,5.76 121.46,4.45 Q4.1 | 122.34,8.67 122.56,8.45 123.51,8.45 R8.1 | 122.34,8.67 122.34,10.3 124.27,12.24 v132.49,12.24
TIME_!BL!_PIN  (via drill 0.33 pad 0.69)
  Top 0.203: R7.1 118.43,8.7 118.71,8.7 119.7,7.71 Q4.3 | v127.47,17.93 130.71,17.93 133.58,15.06 142.98,15.06 143.04,15.12 157.25,15.12 159.56,12.8 IC3.11
  Bottom 0.203: R7.1 119.57,9.84 119.57,10.02 v127.47,17.93
TIME_!LE
  Top 0.203: IC2.31 130.97,12.5 131.31,12.5 132.24,11.57 133.62,11.57 137.6,7.59 137.6,7.3 R12.1
  Bottom 0.203: R12.1 138.75,6.16 137.48,4.89 Q6.1
TIME_!LE!_PIN
  Top 0.203: IC3.12 165.57,10.8 166.65,11.88 S2.4
  Bottom 0.203: 134.85,9.84 136,11 140.74,11 140.78,10.96 148.49,10.96 157.78,20.24 S2.4 S2.3 | 134.85,9.84 134.81,9.84 R11.1 | 134.85,9.84 134.85,4.54 Q6.3
TIME_!POL  (via drill 0.33 pad 0.69)
  Top 0.203: v127.92,15.16 127.78,15.01 IC2.27
  Bottom 0.203: R17.1 128.27,28.07 128.27,15.51 v127.92,15.16
TIME_CLK  (via drill 0.33 pad 0.69)  (1 unrouted)
  Top 0.203: IC2.28 128.57,10.72 130.59,8.7 v135.57,8.7
  Bottom 0.203: v135.57,8.7 150.27,8.7 152.59,11.02 154.5,11.02 157.92,7.59 157.92,7.3 R14.1 159.07,6.16 157.8,4.89 Q7.1
TIME_CLK_PIN  (1 unrouted)
  Top 0.203: R13.1 155.13,9.84 156.29,11.01 160.48,11.01 161.59,9.9 165.79,9.9 170.7,14.8 IC3.7
  Bottom 0.203: R13.1 153.99,8.7 154.27,8.7 155.26,7.71 Q7.3
TIME_DATA_IN
  Top 0.203: IC2.32 131.78,14.91 130.86,15.82 125.05,15.82 124.02,14.8 124.02,12.63 124.95,11.7 125.87,11.7 129.98,7.59 129.98,7.3 R10.1
  Bottom 0.203: R10.1 131.13,6.16 129.86,4.89 Q5.1
TIME_DATA_IN_PIN  (via drill 0.33 pad 0.69)
  Top 0.203: v167.86,9.94 171.34,13.42 177.35,13.42 177.96,12.8 IC3.6 | 127.32,5.69 Q5.3 | 127.32,5.69 127.32,7.71 126.33,8.7 126.05,8.7 R9.1 | 127.32,5.69 138.41,5.69 v138.8,5.3
  Bottom 0.203: v167.86,9.94 159.19,1.27 154.17,1.27 149.55,5.89 139.4,5.89 v138.8,5.3
TXD_PIN  (via drill 0.33 pad 0.69)
  Top 0.203: v165.83,3.13 165.83,3.06 165.57,2.8 IC3.16
  Bottom 0.203: JP3.RXI 168.91,37.4 165.48,33.97 164.71,33.97 163.93,33.19 163.93,32.23 164.63,31.53 165.43,31.53 168.53,28.42 168.53,8.58 165.16,5.21 165.16,3.8 v165.83,3.13
VCC  (via drill 0.33 pad 0.69)
  Top 0.305: R14.2 147.06,7.3 141.54,12.82 137.59,12.82 C2.1 | IC2.30 130.18,12.45 130.37,12.45 v131.25,11.56 | R8.2 R6.2 | C4.1 IC1.5 | R2.2 66.61,7.3 62.49,3.17 C4.1 | C4.1 52.14,1.97 40.98,1.97 36.61,6.35 C1.+ 19.05,10.16 19.05,11.08 | 19.05,11.08 BAT1.+ | 19.05,11.08 J4.TIP | JP1.2 9.92,24.37 IC4.IN
  Bottom 0.305: 132.41,9.38 133.3,8.5 133.67,8.5 R12.2 | 132.41,10.4 132.41,9.38 | 132.41,9.38 131.6,8.57 128.51,8.57 127.24,7.3 R10.2 124.85,7.3 124.85,6.93 124.02,6.1 120.82,6.1 119.62,7.3 R8.2 | JP3.VCC 162.59,39.4 162.59,26.56 147.44,11.42 140.96,11.42 139.68,12.7 C2.1 137.04,13.13 | v131.25,11.56 132.41,10.4 | 137.04,13.13 135.41,11.5 133.5,11.5 132.41,10.4 | 137.04,13.13 133.4,16.78 133.4,27.97 128.27,33.1 R17.2 | BAT1.+ 17.34,13.97 12.7,18.61 IC4.IN | R6.2 99.45,7.3 98.24,8.52 95.06,8.52 94.22,7.67 94.22,7.3 R4.2 91.83,7.3 90.61,8.52 82.74,8.52 81.52,7.3 R2.2

### Text on the board
tNames: HV | G-IN | GND | VCC | Reset | Bootloader | GND